# Altium schematic sheet Altium Schematic.SchDoc
size B; SheetNumber: 7; SheetTotal: 11
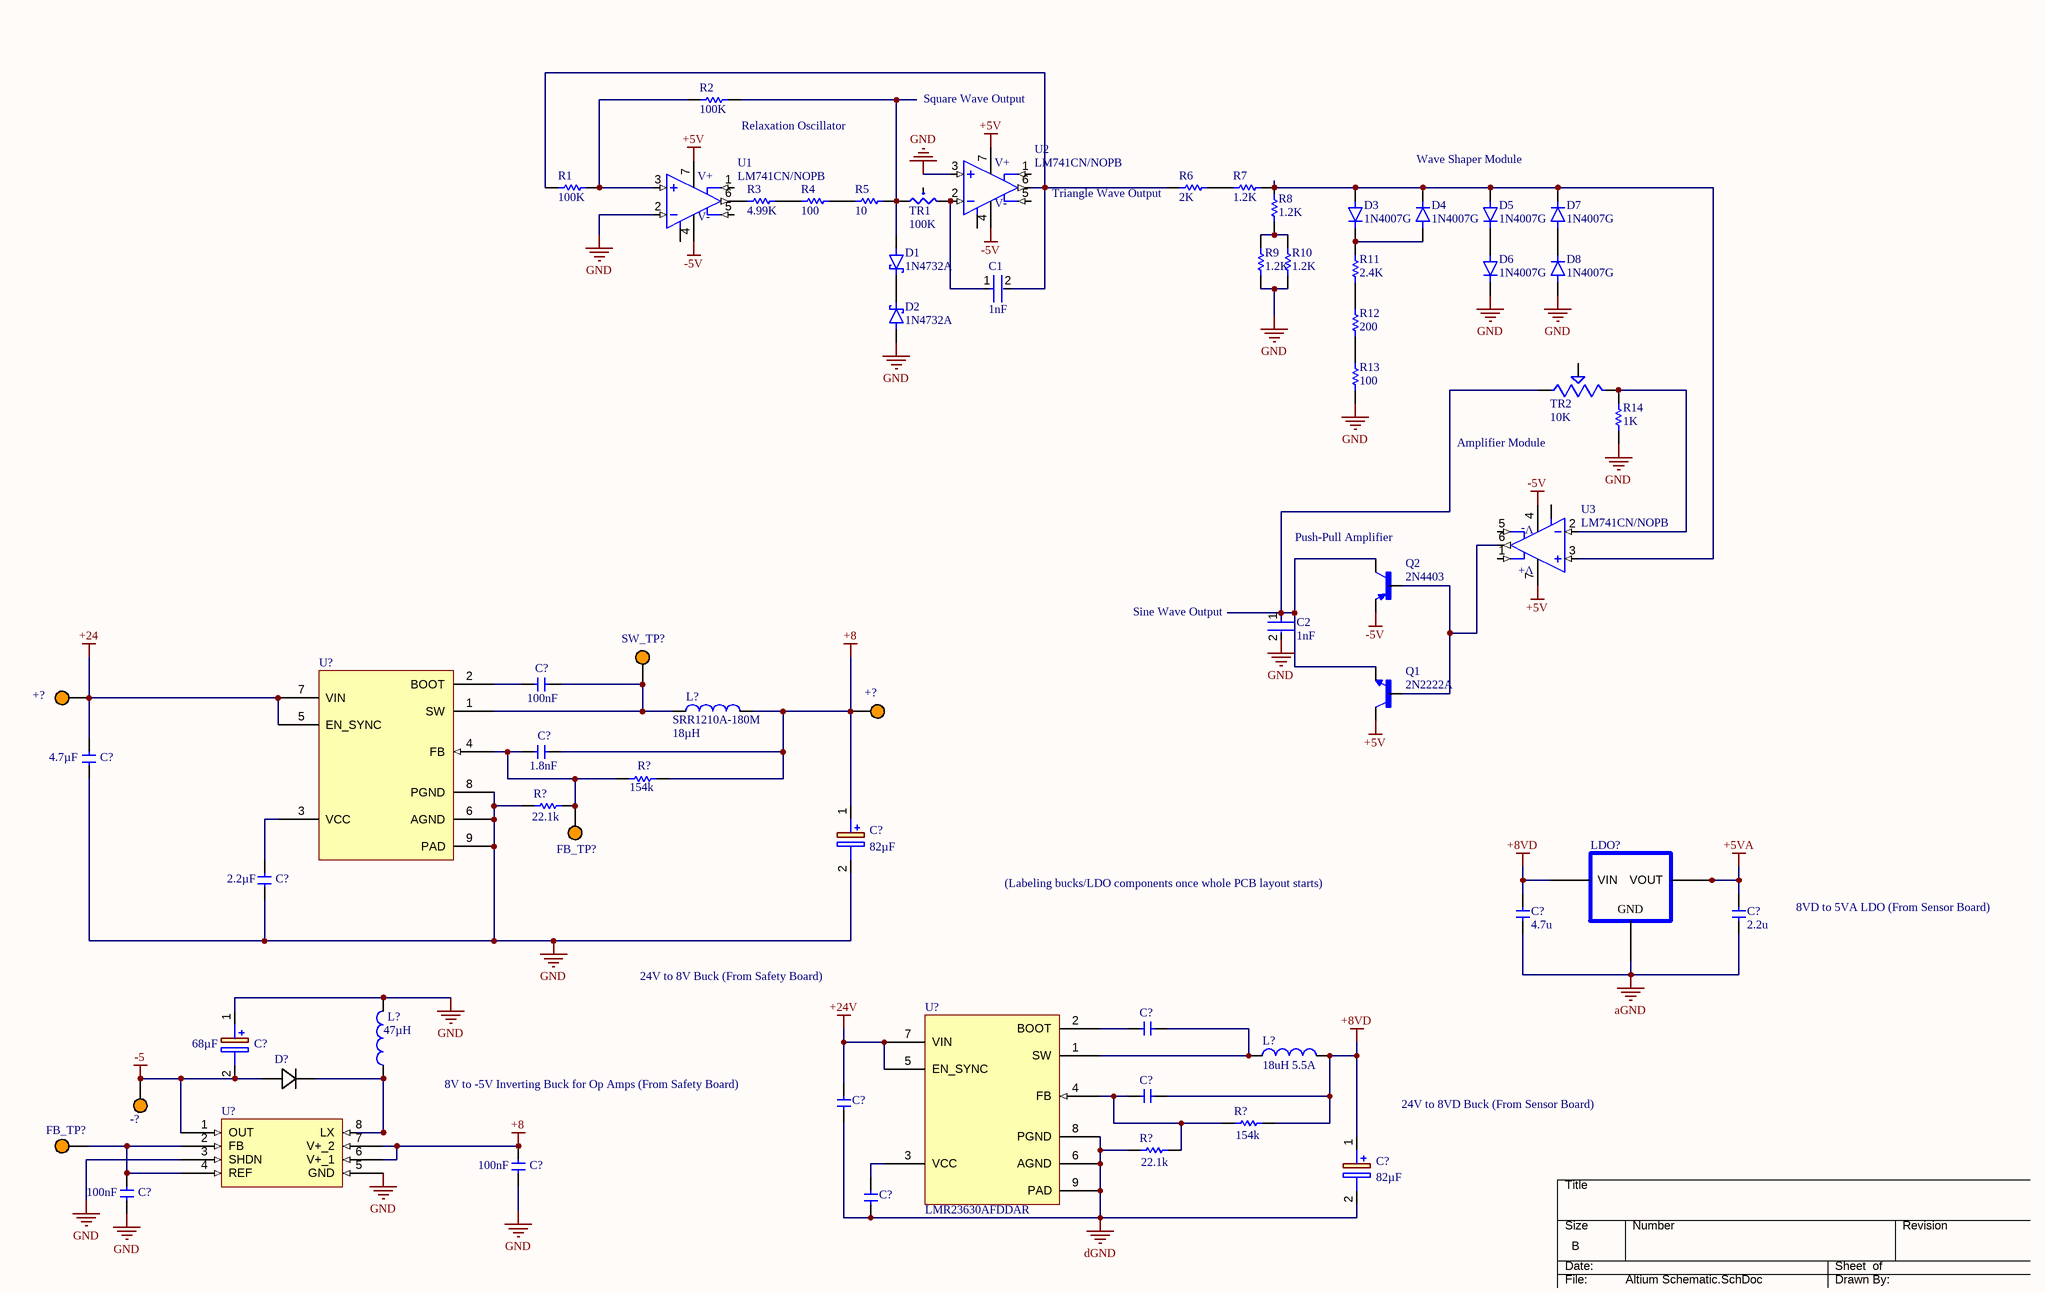
[diagram p0: Altium Schematic.SchDoc]

## Parts
(Parts that share a designator on the sheet are numbered #1, #2 ... from top to bottom, then left to right.)
+?#1  5013  [TP_5013]  (value not drawn)
+?#2  5013  [TP_5013]  (value not drawn)
-?  5013  [TP_5013]  (value not drawn)
C1  1nF  [CAP-0603]
C2  1nF  [CAP-0603]
C?#1  Capacitance: 100nF  [CAPC1608X08N]  (hidden comment: CL10B104KB8NNNC)
C?#2  Capacitance: 1.8nF  [CAPC1608X08N]  (hidden comment: CC0805JRNPO9BN182)
C?#3  Capacitance: 4.7µF  [CAP-0805]  (hidden comment: C2012X7R1H475K125AC)
C?#4  Capacitance: 82µF  [New footprint 1]  (hidden comment: EEE-FKH820XSP)
C?#5  Capacitance: 2.2µF  [CAP-0805]  (hidden comment: C2012X7R2A225K125AC)
C?#6  4.7u  [CAP-0603]
C?#7  2.2u  [CAP-0603]
C?#8  CL10B104KB8NNNC  [CAPC1608X08N]  (value not drawn)
C?#9  Capacitance: 68µF  [EEEEKV680XAL]  (hidden comment: EEE-FKV680XAL)
C?#10  CC0805JRNPO9BN182  [CAPC1608X08N]  (value not drawn)
C?#11  C2012X7R1H475K125AC  [CAP-0805]  (value not drawn)
C?#12  Capacitance: 100nF  [CAPC1608X08N]  (hidden comment: CL10B104KB8NNNC)
C?#13  Capacitance: 82µF  [New footprint 1]  (hidden comment: EEE-FKH820XSP)
C?#14  Capacitance: 100nF  [CAPC1608X08N]  (hidden comment: CL10B104KB8NNNC)
C?#15  C2012X7R2A225K125AC  [CAP-0805]  (value not drawn)
D1  1N4732A  [DIOAD1036W78L463D237]
D2  1N4732A  [DIOAD1036W78L463D237]
D3  1N4007G  [DIOAD1036W78L470D235]
D4  1N4007G  [DIOAD1036W78L470D235]
D5  1N4007G  [DIOAD1036W78L470D235]
D6  1N4007G  [DIOAD1036W78L470D235]
D7  1N4007G  [DIOAD1036W78L470D235]
D8  1N4007G  [DIOAD1036W78L470D235]
D?  SM5817PL-TP  [SM5817PL-TP-Footprint-1]  (value not drawn)
FB_TP?#1  Via_Testpoint  [Via_Testpoint]  (value not drawn)
FB_TP?#2  Via_Testpoint  [Via_Testpoint]  (value not drawn)
L?#1  SRR1210A-180M  Inductance: 18µH  [INDPM120120X1000N]
L?#2  Inductance: 47µH  [CLF7045NIT-470M-D]  (hidden comment: CLF7045NIT-470M-D)
L?#3  18uH 5.5A  [INDPM120120X1000N]
LDO?  SPX1117M3-L-5-0/TR  [SOT223]  (value not drawn)
Q1  2N2222A  [TO92254P470H750-3]
Q2  2N4403  [TO92]
R1  100K  [RESC1608X06N]
R2  100K  [RESC1608X06N]
R3  4.99K  [RESC1608X06N]
R4  100  [RESC1608X06N]
R5  10  [RESC1608X06N]
R6  2K  [RESC1608X06N]
R7  1.2K  [RESC1608X06N]
R8  1.2K  [RESC1608X06N]
R9  1.2K  [RESC1608X06N]
R10  1.2K  [RESC1608X06N]
R11  2.4K  [RESC1608X06N]
R12  200  [RESC1608X06N]
R13  100  [RESC1608X06N]
R14  1K  [RESC1608X06N]
R?#1  Resistance: 154k  [RES-0603]  (hidden comment: ERJ-3EKF1543V)
R?#2  Resistance: 22.1k  [RESC1608X06N]  (hidden comment: ERJ-3EKF2212V)
R?#3  ERJ-3EKF1543V  [RES-0603]  (value not drawn)
R?#4  ERJ-3EKF2212V  [RESC1608X06N]  (value not drawn)
SW_TP?  Via_Testpoint  [Via_Testpoint]  (value not drawn)
TR1  100K  [TRIMPOT_PV36W]
TR2  10K  [TRIM_PV36W103C01B00]
U1  LM741CN/NOPB  [DIP794W45P254L959H508Q8]
U2  LM741CN/NOPB  [DIP794W45P254L959H508Q8]
U3  LM741CN/NOPB  [DIP794W45P254L959H508Q8]
U?#1  LMR23630AFDDAR  [DDA0008E_N]  (value not drawn)
U?#2  LMR23630AFDDAR  [DDA0008E_N]
U?#3  MAX764CSA+  [MAX764CSA+-Footprint-1]  (value not drawn)

## Nets
+5V: Q1.3(C) U1.7(V+) U2.7(V+) U3.7(V+)
+5VA: C?#7.2 LDO?.2(VOUT) LDO?.4
+8: +?#2.TP C?#2.2 C?#4.1(+) C?#12.2 L?#1.2 R?#1.2 U?#3.6(V+_1) U?#3.7(V+_2)
+8VD: C?#6.2 C?#10.2 C?#13.1(+) L?#3.2 LDO?.3(VIN) R?#3.2
+24: +?#1.TP C?#3.2 U?#1.5(EN_SYNC) U?#1.7(VIN)
+24V: C?#11.2 U?#2.5(EN_SYNC) U?#2.7(VIN)
-5: -?.TP C?#9.2(-) D?.2 U?#3.1(OUT)
-5V: Q2.1(E) U1.4(V-) U2.4(V-) U3.4(V-)
aGND: C?#6.1 C?#7.1 LDO?.1(GND)
dGND: C?#11.1 C?#13.2(-) C?#15.1 R?#4.1 U?#2.6(AGND) U?#2.8(PGND) U?#2.9(PAD)
GND: C2.2 C?#3.1 C?#4.2(-) C?#5.1 C?#9.1(+) C?#12.1 C?#14.1 D2.2(A) D6.C(K) D8.A L?#2.2 R9.1 R10.1 R13.1 R14.2 R?#2.1 U1.2(-IN) U2.3(+IN) U?#1.6(AGND) U?#1.8(PGND) U?#1.9(PAD) U?#3.3(SHDN) U?#3.5(GND)
NetC1_1: C1.1 TR1.3 U2.2(-IN)
NetC1_2: C1.2 R1.1 R6.1 U2.6(OUT)
NetC2_1: C2.1 Q1.1(E) Q2.3(C) TR2.1
NetC?#1_1: C?#1.1 U?#1.2(BOOT)
NetC?#1_2: C?#1.2 L?#1.1 SW_TP?.TP U?#1.1(SW)
NetC?#2_1: C?#2.1 FB_TP?#1.TP R?#1.1 R?#2.2 U?#1.4(FB)
NetC?#5_2: C?#5.2 U?#1.3(VCC)
NetC?#8_1: C?#8.1 U?#2.2(BOOT)
NetC?#8_2: C?#8.2 L?#3.1 U?#2.1(SW)
NetC?#10_1: C?#10.1 R?#3.1 R?#4.2 U?#2.4(FB)
NetC?#14_2: C?#14.2 FB_TP?#2.TP U?#3.2(FB) U?#3.4(REF)
NetC?#15_2: C?#15.2 U?#2.3(VCC)
NetD1_1: D1.1(K) D2.1(K)
NetD1_2: D1.2(A) R2.2 R5.2 TR1.1
NetD3_A: D3.A D4.C(K) D5.A D7.C(K) R7.2 R8.2 U3.3(+IN)
NetD3_C: D3.C(K) D4.A R11.2
NetD5_C: D5.C(K) D6.A
NetD7_A: D7.A D8.C(K)
NetD?_1: D?.1 L?#2.1 U?#3.8(LX)
NetQ1_2: Q1.2(B) Q2.2(B) U3.6(OUT)
NetR1_2: R1.2 R2.1 U1.3(+IN)
NetR3_1: R3.1 U1.6(OUT)
NetR3_2: R3.2 R4.1
NetR4_2: R4.2 R5.1
NetR6_2: R6.2 R7.1
NetR8_1: R8.1 R9.2 R10.2
NetR11_1: R11.1 R12.2
NetR12_1: R12.1 R13.2
NetR14_1: R14.1 TR2.3 U3.2(-IN)

Not connected (* = marked no-connect by the designer): TR1 2; TR2 2; U1 1(OFFSE_NULL1) 5(OFFSET_NULL5) 8(NC); U2 1(OFFSE_NULL1) 5(OFFSET_NULL5) 8(NC); U3 1(OFFSE_NULL1) 5(OFFSET_NULL5) 8(NC)

## Notes on the sheet
- Square Wave Output
- (near R2) Relaxation Oscillator
- Wave Shaper Module
- (near R6) Triangle Wave Output
- Amplifier Module
- (near Q2) Push-Pull Amplifier
- (near C2) Sine Wave Output
- (Labeling bucks/LDO components once whole PCB layout starts)
- 8VD to 5VA LDO (From Sensor Board)
- 24V to 8V Buck (From Safety Board)
- 8V to -5V Inverting Buck for Op Amps (From Safety Board)
- 24V to 8VD Buck (From Sensor Board)
- (near R?#4) 22.1k
- (near R?#3) 154k

## Library data of the parts
+?#1 +?#2 -? = CMP-00003-4: PC TEST POINT MULTIPURP ORANGE; Designer(firstname.lastname): satvik.reddy
C1 C2 = CMP-00050-2: Cap Ceramic 0.001uF 100V C0G 1% Pad SMD 0603 125C Automotive T/R; Manufacturer Lifecycle Status: IN PRODUCTION; Temperature Coefficient: 30ppm/°C; Height: 800µm; Tolerance: 1%; Number of Terminals: 2; Voltage Rating: 100V; RoHS: Compliant; Material: Ceramic; Lifecycle Status: Production; Value: 1nF; Mounting Technology: Surface Mount; Voltage Rating (DC): 100V; Length: 1.6mm; Min Operating Temperature: -55°C; Thickness: 800µm; Max Operating Temperature: 125°C; Width: 800µm; Schedule B: 8532240020; Dielectric Material: Ceramic; Case/Package: 0603; REACH SVHC: Yes
C?#1 C?#12 C?#14 = CMP-050-000000-3: CAP CER 0.1UF 50V X7R 0603; Designer (firstname.lastname): amol.tandon; Case Code (Imperial): 0603; Voltage Rating: 50V; Temperature Coefficient: X7R
C?#2 = CMP-050-000008-2: 0805 1.8 nF 50 V ±5 % Tolerance NP0 SMT Multilayer Ceramic Capacitor; Designer (firstname.lastname): felipe.gomes; Voltage Rating: 50V; Design Item ID: CC0805JRNPO9BN182; Case Code (Imperial): 0805; Temperature Coefficient: NP0
C?#3 = CMP-050-000003-2: CAP CER 4.7uF 50V X7R 0805; Designer (firstname.lastname): amol.tandon; Case Code (Imperial): 0805; Temperature Coefficient: X7R; Voltage Rating: 50V
C?#4 C?#13 = CMP-050-000016-1: CAP ALUM 82UF 20% 50V SMD; Designer (firstname.lastname): nathan.zou; Temperature Coefficient: n/a; Voltage Rating: 50V; Case Code (Imperial): Radial, Can - SMD
C?#5 = CMP-050-000002-4: CAP CER 2.2uF 100V X7R 0805; Designer (firstname.lastname): amol.tandon; Case Code (Imperial): 0805; Voltage Rating: 100V; Temperature Coefficient: X7R
C?#6 = CMP-050-000012-3: 0603 4.7 nF 50 V ±5 % Tolerance C0G/NP0 SMT Multilayer Ceramic Capacitor; Capacitance: 2.2u; Designer (firstname.lastname): gary.jiang; Temperature Coefficient: C0G; Voltage Rating: 50V; Case Code (Imperial): 0603
C?#7 = CMP-050-000012-3: 0603 4.7 nF 50 V ±5 % Tolerance C0G/NP0 SMT Multilayer Ceramic Capacitor; Designer (firstname.lastname): gary.jiang; Temperature Coefficient: C0G; Voltage Rating: 50V; Capacitance: 2.2u; Case Code (Imperial): 0603
C?#8 = CMP-050-000000-2: CAP CER 0.1UF 50V X7R 0603; Capacitance: 100nF; Designer (firstname.lastname): amol.tandon; Case Code (Imperial): 0603; Voltage Rating: 50V; Temperature Coefficient: X7R
C?#9 = CMP-050-000023-3: Aluminum Electrolytic Capacitor, Polarized, Aluminum (wet), 35V, 20% +Tol, 20% -Tol, 68uF, Surface Mount, 2626; Temperature Coefficient: 105; Designer (firstname.lastname): ritvik.gupta; Voltage Rating: 35V; Case Code (Imperial): SMD
C?#10 = CMP-050-000008-1: 0805 1.8 nF 50 V ±5 % Tolerance NP0 SMT Multilayer Ceramic Capacitor; Designer (firstname.lastname): felipe.gomes; Capacitance: 1.8nF; Voltage Rating: 50V; Design Item ID: CC0805JRNPO9BN182; Case Code (Imperial): 0805; Temperature Coefficient: NP0
C?#11 = CMP-050-000003-1: CAP CER 4.7uF 50V X7R 0805; Capacitance: 4.7µF; Designer (firstname.lastname): amol.tandon; Case Code (Imperial): 0805; Temperature Coefficient: X7R; Voltage Rating: 50V
C?#15 = CMP-050-000002-3: CAP CER 2.2uF 100V X7R 0805; Designer (firstname.lastname): amol.tandon; Capacitance: 2.2µF; Case Code (Imperial): 0805; Voltage Rating: 100V; Temperature Coefficient: X7R
D1 D2 = 1N4732A: Zener Diode 4.7 V 1 W Â±5% Through Hole DO-41G; MF: ON Semiconductor; SnapEDA_Link: https://www.snapeda.com/parts/1N4732A/Onsemi/view-part/?ref=snap; Package: DO-41 Fairchild Semiconductor; Value: *; MP: 1N4732A; Check_prices: https://www.snapeda.com/parts/1N4732A/Onsemi/view-part/?ref=eda
D3-D8 = 1N4007G: 1A, 1000V, Standard Rectifier; MF: Taiwan Semiconductor; SnapEDA_Link: https://www.snapeda.com/parts/1N4007G/taiwan/view-part/?ref=snap; Package: DO-41-2 Taiwan Semiconductor; Value: *; MP: 1N4007G; Check_prices: https://www.snapeda.com/parts/1N4007G/taiwan/view-part/?ref=eda
D? = CMP-051-000017-5: Rectifier Diode, Schottky, 1 Phase, 1 Element, 1A, 20V V(RRM), Silicon; Designer (firstname.lastname): ritvik.gupta; Forward Voltage: 450mV; Reverse Voltage: 20V; Case Code (Imperial): SOD-123F
FB_TP?#1 FB_TP?#2 SW_TP? = CMP-00024-1: Testpoint with a hole for oscope probing; Designer(firstname.lastname): satvik.reddy
L?#1 L?#3 = CMP-052-000002-2: FIXED IND 18UH 5.5A 35 MOHM SMD; Designer (firstname.lastname): satvik.reddy; Case Code (Imperial): 1210
L?#2 = CMP-052-000003-2: Ind Power Shielded Wirewound 47uH 20% 100KHz Ferrite 1.7A T/R; Designer (firstname.lastname): ritvik.gupta; Tolerance: 20%; Case Code (Imperial): SMD
LDO? = CMP-125-000002-6: SPX1117 Series 5 V Fixed Output 800 mA SMT LDO Regulator - SOT-223-3 T/R; Number of Outputs: 1; Min Current Limit: 1A; Output Voltage: 5V; Output Voltage Accuracy: 1%; Polarity: Positive; Max Supply Voltage: 12V; Quiescent Current: 10mA; Dropout Voltage: 1.1V; Max Output current: 800mA; Voltage Tolerance: 2%; Min Input Voltage: 6.5V; Max Junction Temperature (Tj): 125°C; Max Operating Temperature: 125°C; Radiation Hardening: No; Height - Seated (Max): 1.8mm; Case/Package: SOT-223; Number of Channels: 1; Lead Free: Lead Free; Width: 3.5mm; Number of Circuits: 1; Packaging: Tape and Reel; Min Operating Temperature: -40°C; Number of Regulators: 1; Number of Terminals: 3; Length: 6.5mm; Mounting Technology: Surface Mount; Schedule B: 8542310000; REACH SVHC: Yes; RoHS: Compliant; Min Output Voltage: 5V; Lifecycle Status: Production; Terminal Pitch: 2.3mm; Output Current: 800mA; Output Type: Fixed; Pins: 4
Q1 = 2N2222A: BJT, TO-92, 40V, 600mA, NPN, 0.625W, 150Â°C; MF: Diotec Semiconductor; SnapEDA_Link: https://www.snapeda.com/parts/2N2222A/Diotec/view-part/?ref=snap; Package: TO-92 Diotec; Value: *; MP: 2N2222A; Check_prices: https://www.snapeda.com/parts/2N2222A/Diotec/view-part/?ref=eda
Q2 = 2N4403: Bipolar (BJT) Transistor PNP 40 V 600 mA 200MHz 625 mW Through Hole TO-92-3; MF: Central Semiconductor; SnapEDA_Link: https://www.snapeda.com/parts/2N4403/Central+Components+Manufacturing/view-part/?ref=snap; Package: TO-92 Central Semiconductor; Value: *; MP: 2N4403; Check_prices: https://www.snapeda.com/parts/2N4403/Central+Components+Manufacturing/view-part/?ref=eda
R1 R2 = CMP-055-000002-16: RES SMD 100K OHM 1% 1/10W 0603; Designer (firstname.lastname): curtis.lam
R3 = CMP-055-000010-19: RES SMD 4.99K OHM 1% 1/10W 0603; Designer (firstname.lastname): satvik.reddy
R4 R13 = CMP-055-000005-20: RES SMD 100 OHM 1% 1/10W 0603; Designer (firstname.lastname): curtis.lam
R5 = CMP-055-000001-16: RES SMD 10 OHM 1% 1/10W 0603; Designer (firstname.lastname): satvik.reddy
R6 = CMP-055-000037-1: RES SMD 2K OHM 1% 1/10W 0603; Designer (firstname.lastname): ritvik.gupta
R7-R10 = CMP-055-000063-1: RES SMD 1.2K OHM 1% 1/10W 0603; Designer (firstname.lastname): satvik.reddy
R11 = CMP-055-000014-2: RES SMD 2.4K OHM 1% 1/10W 0603; Designer (firstname.lastname): benson.zhou
R12 = CMP-055-000006-16: RES SMD 200 OHM 1% 1/10W 0603; Designer (firstname.lastname): satvik.reddy
R14 = CMP-055-000009-16: RES SMD 1K OHM 1% 1/10W 0603; Designer (firstname.lastname): satvik.reddy
R?#1 R?#3 = CMP-055-000041-1: RES SMD 154K OHM 1% 1/10W 0603; Value: 806Ω; Voltage Rating (DC): 75V; Current Rating: 1A; Max Voltage: 150V; Temperature Coefficient: 100ppm/°C; Power Rating: 100mW; Designer (firstname.lastname): albert.he; Case Code (Imperial): 0603; Length: 1.6mm; Voltage Rating: 75V; Termination: SMD/SMT; Max Operating Temperature: 155°C; Composition: Thick Film; Width: 800µm; Tolerance: 1%; Height: 450µm; Case Code (Metric): 1608; RoHS: Compliant; Min Operating Temperature: -55°C; Case/Package: 0603; Weight: 2.012816mg
  R?#3: Resistance: 154k
R?#2 = CMP-055-000040-2: RES SMD 22.1K OHM 1% 1/10W 0603; Max Voltage: 75V; Power Rating: 100mW; Designer (firstname.lastname): satvik.reddy; Case Code (Imperial): 0603; Tolerance: 1%
R?#4 = CMP-055-000040-1: RES SMD 22.1K OHM 1% 1/10W 0603; Resistance: 22.1; Power Rating: 100mW; Designer (firstname.lastname): satvik.reddy; Max Voltage: 75V; Tolerance: 1%; Case Code (Imperial): 0603
TR1 = CMP-055-000025-2: Trimmer Potentiometer, 100kΩ, 25 turns, 0.5 W, THT; Designer (firstname.lastname): amol.tandon
TR2 = PV36W103C01B00: 10 kOhms 0.5W, 1/2W PC Pins Through Hole Trimmer Potentiometer Cermet 25.0 Turn Top Adjustment; MF: Bourns; DigiKey_Part_Number: 118-PV36W103C01B00-ND; Purchase-URL: https://pricing.snapeda.com/search?q=PV36W103C01B00&ref=eda; Package: PV36W Bourns; Check_prices: https://www.snapeda.com/parts/PV36W103C01B00/Bourns/view-part/?ref=eda; Value: *; SnapEDA_Link: https://www.snapeda.com/parts/PV36W103C01B00/Bourns/view-part/?ref=snap; MP: PV36W103C01B00
U1-U3 = LM741CN/NOPB: MF: {'manufacturer': u'Texas Instruments'}; Package: None; Price: None; Value: *; MP: LM741CN/NOPB; Availability: Unavailable
U?#1 = CMP-125-000000-4: IC REG BUCK ADJ 3A 8SOPWR; Manufacturer Lifecycle Status: ACTIVE; Min Supply Voltage: 4V; Switching Frequency: 400kHz; Quiescent Current: 75µA; Max Supply Voltage: 36V; Number of Outputs: 1; Max Junction Temperature (Tj): 125°C; Topology: Buck; Thickness: 1.48mm; Height: 1.7mm; Length: 4.89mm; Width: 3.9mm; Output Current: 3A; RoHS: Compliant; Min Operating Temperature: -40°C; Lead Free: Lead Free; Max Operating Temperature: 125°C; Lifecycle Status: Production; Schedule B: 8542390000; Nominal Supply Current: 75µA; Pins: 8; Number of Channels: 1
U?#2 = CMP-125-000000-3: IC REG BUCK ADJ 3A 8SOPWR; Manufacturer Lifecycle Status: ACTIVE; Min Supply Voltage: 4V; Switching Frequency: 400kHz; Quiescent Current: 75µA; Max Supply Voltage: 36V; Number of Outputs: 1; Max Junction Temperature (Tj): 125°C; Topology: Buck; Thickness: 1.48mm; Height: 1.7mm; Length: 4.89mm; Width: 3.9mm; Output Current: 3A; RoHS: Compliant; Min Operating Temperature: -40°C; Lead Free: Lead Free; Max Operating Temperature: 125°C; Lifecycle Status: Production; Schedule B: 8542390000; Nominal Supply Current: 75µA; Pins: 8; Number of Channels: 1
U?#3 = CMP-125-000008-2: MAX764 Series 16 V 260 mA 300 kHz Buck/Boost SMT Switching Regulator - SOIC-8; Manufacturer Lifecycle Status: PRODUCTION; Efficiency: 80%; Number of Channels: 1; Max Supply Voltage: 16.5V; Max Output Voltage: -16V; Min Input Voltage: 3V; Min Output Voltage: -1V; Output Current: 260mA; Operating Supply Voltage: 16V; Synchronous Rectifier: No; Output Type: Adjustable, Fixed; Frequency: 300kHz; Max Output Power: 1.5W; Evaluation Kit: Yes; Max Output current: 1.5A; Pins: 8; Mounting Technology: Surface Mount; Packaging: Cut Tape; Radiation Hardening: No; Number of Outputs: 1; Lifecycle Status: Production; Lead Free: Lead Free; Case/Package: SOIC; Min Operating Temperature: 0°C; Width: 4mm; Length: 5mm; Output Voltage: -16V; RoHS: Compliant; Max Operating Temperature: 70°C; REACH SVHC: Unknown; Schedule B: 8542390000; Min Supply Voltage: 3V; Switching Frequency: 300kHz; Height: 1.5mm